# Altium project TMP-1-A.PrjPcb
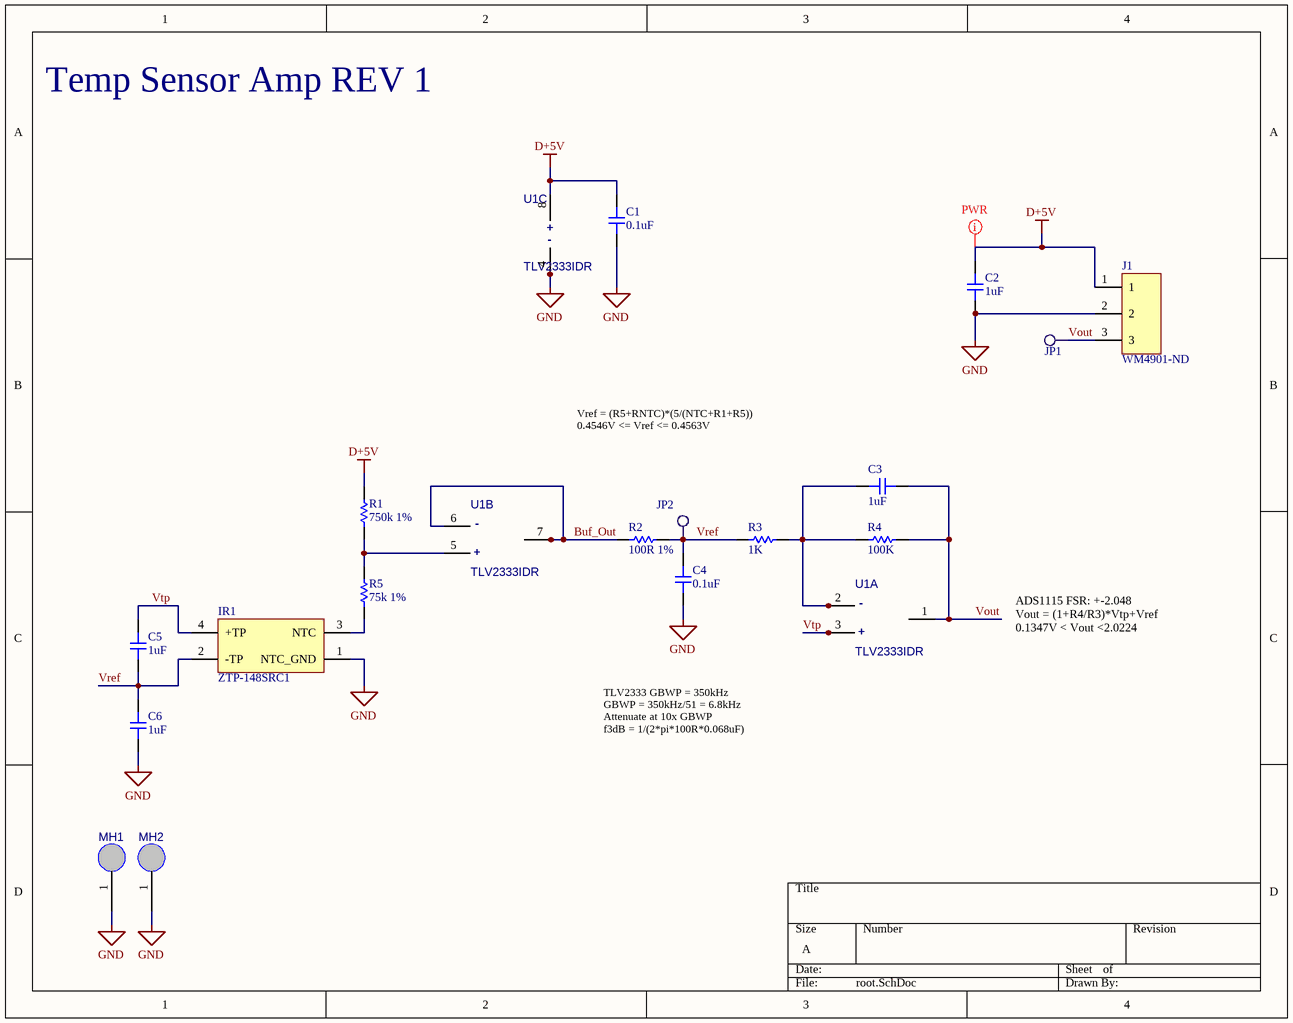
[diagram p0: root.SchDoc]
1 sheet, 18 parts. Net scope: global (net labels, ports and power ports of the same name join across sheets).
Board file: TMP-1-A.PcbDoc

## Sheet root.SchDoc
size A

### Parts
C1  0.1uF  [CAP-0603]
C2  1uF  [CAP-0603]
C3  1uF  [CAP-0603]
C4  0.1uF  [CAP-0603]
C5  1uF  [CAP-0603]
C6  1uF  [CAP-0603]
IR1  ZTP-148SRC1  [ZTP-148SRC1]
J1  WM4901-ND  [3PIN]
JP1  Testpoint2  [TP2]  (value not drawn)
JP2  Testpoint2  [TP2]  (value not drawn)
MH1  MountingHole  [MH4.2MM]  (value not drawn)
MH2  MountingHole  [MH4.2MM]  (value not drawn)
R1  750k 1%  [RES-0603]
R2  100R 1%  [RES-0603]
R3  1K  [RES-0603]
R4  100K  [RES-0603]
R5  75k 1%  [RES-0603]
U1  TLV2333IDR  [TSSOP65P505X110-8]  (parts A,B,C of 3)

### Nets
D+5V: C1.2 C2.2 J1.1 R1.2 U1.8(VDD+)
GND: C1.1 C2.1 C4.1 C6.1 IR1.1(NTC_GND) J1.2 MH1.1 MH2.1 U1.4(VDD-)
Buf_Out: R2.1 U1.6(2IN-) U1.7(2OUT)
Vout: C3.1 J1.3 JP1.1 R4.2 U1.1(1OUT)
Vref: C4.2 C5.1 C6.2 IR1.2(-TP) JP2.1 R2.2 R3.1
Vtp: C5.2 IR1.4(+TP) U1.3(1IN+)
NetC3_2: C3.2 R3.2 R4.1 U1.2(1IN-)
NetIR1_3: IR1.3(NTC) R5.1
NetR1_1: R1.1 R5.2 U1.5(2IN+)

### Layout directives
mark named PWR: D+5V

### Notes on the sheet
- Temp Sensor Amp REV 1
- Vref = (R5+RNTC)*(5/(NTC+R1+R5))
  0.4546V <= Vref <= 0.4563V
- ADS1115 FSR: +-2.048
  Vout = (1+R4/R3)*Vtp+Vref
  0.1347V < Vout <2.0224
- TLV2333 GBWP = 350kHz
  GBWP = 350kHz/51 = 6.8kHz
  Attenuate at 10x GBWP
  f3dB = 1/(2*pi*100R*0.068uF)
- (in symbol IC_TLV2333, part A) -; +
- (in symbol IC_TLV2333, part B) -; +
- (in symbol IC_TLV2333, part C) +; -

### Library data of the parts
C1 C4 = 0603-0.1uF-16V: CAP CER 0.1UF 16V X7R 0603; Manufacturer: KEMET; Manufacturer Part Number: C0603C104M4RACTU; Dielectric Material: Ceramic; Capacitance: 100nF; Tolerance: 20%; Supplier 1: Digi-Key; Stock 1: 254524; Pricing 1: 1=0.1, 10=0.036, 100=0.0161, 500=0.01152, 1000=0.00904 (USD); Mount: Surface Mount,PCB; Case/Package: 0603; Number of Pins: 2; Case Code (Metric): 1608; Case Code (Imperial): 0603; Min Operating Temperature: -55°C; Max Operating Temperature: 125°C; Package Quantity: 1; Voltage Rating: 16V; Packaging: Tape and Reel; Voltage Rating (DC): 16V; Dielectric: X7R; Termination: SMD/SMT; Length: 1.6mm; Height: 0.8mm; Width: 0.031inch; Thickness: 0.034inch; Lead Pitch: 0.7mm; Depth: 0.8mm; Radiation Hardening: No; REACH SVHC: No SVHC; ComponentLink1URL: https://www.verical.com/server-webapp/html/getDatasheet?partID=66190&src-supplier=Verical; ComponentLink1Description: https://www.verical.com/server-webapp/html/getDatasheet?partID=66190&src-supplier=Verical; ComponentLink2URL: http://www.farnell.com/datasheets/2746055.pdf?src-supplier=Element14; ComponentLink2Description: http://www.farnell.com/datasheets/2746055.pdf?src-supplier=Element14; ComponentLink3URL: http://www.farnell.com/datasheets/2123765.pdf?src-supplier=Element14; ComponentLink3Description: http://www.farnell.com/datasheets/2123765.pdf?src-supplier=Element14; ComponentLink4URL: http://www.alliedelec.com/m/d/9bfe7773041ffe9d406e68bc7b377fdd.pdf?src-supplier=Allied+Electronics; ComponentLink4Description: http://www.alliedelec.com/m/d/9bfe7773041ffe9d406e68bc7b377fdd.pdf?src-supplier=Allied+Electronics; ComponentLink5URL: https://www.verical.com/server-webapp/html/getDatasheet?partID=302288&src-supplier=Verical; ComponentLink5Description: https://www.verical.com/server-webapp/html/getDatasheet?partID=302288&src-supplier=Verical; Supplier Part Number 1: 399-1099-6-ND
C2 C3 C5 C6 = 0603-1uF-16V: CAP CER 1UF 16V X7R 0603; Manufacturer: KEMET; Manufacturer Part Number: C0603C105K4RACTU; Dielectric Material: Ceramic; Tolerance: 10%; Dissipation Factor: 3.5%; Supplier 1: Digi-Key; Stock 1: 600463; Pricing 1: 1=0.12, 10=0.088, 100=0.0391, 500=0.02792, 1000=0.02193 (USD); Mount: Surface Mount,PCB; Case/Package: 0603; Number of Pins: 2; Case Code (Metric): 1608; Case Code (Imperial): 0603; Contact Plating: Tin,Matte; Min Operating Temperature: -55°C; Max Operating Temperature: 125°C; Package Quantity: 4000; Capacitance: 1uF; Voltage Rating: 16V; Packaging: Tape and Reel; Voltage Rating (DC): 16V; Dielectric: X7R; Termination: SMD/SMT; Voltage: 16V; Length: 1.6mm; Height: 0.8mm; Width: 0.031inch; Thickness: 0.034inch; Depth: 0.8mm; Radiation Hardening: No; REACH SVHC: No SVHC; ComponentLink1URL: http://www.mouser.com/ds/2/212/KEM_C1002_X7R_SMD-1102033.pdf?src-supplier=Mouser; ComponentLink1Description: http://www.mouser.com/ds/2/212/KEM_C1002_X7R_SMD-1102033.pdf?src-supplier=Mouser; ComponentLink2URL: http://www.kemet.com/kemet/web/homepage/kechome.nsf/file/Commercial%20Ceramic%20Chips%20X7R%20Dielectric/$file/KEM_C1002_X7R_SMD.pdf?src-supplier=Element14; ComponentLink2Description: http://www.kemet.com/kemet/web/homepage/kechome.nsf/file/Commercial%20Ceramic%20Chips%20X7R%20Dielectric/$file/KEM_C1002_X7R_SMD.pdf?src-supplier=Element14; ComponentLink3URL: https://www.verical.com/server-webapp/html/getDatasheet?partID=385479&src-supplier=Verical; ComponentLink3Description: https://www.verical.com/server-webapp/html/getDatasheet?partID=385479&src-supplier=Verical; ComponentLink4URL: http://www.kemet.com/kemet/web/homepage/kechome.nsf/vapubfiles/KEM_C1002_X7R_SMD.pdf/$file/KEM_C1002_X7R_SMD.pdf?src-supplier=Element14; ComponentLink4Description: http://www.kemet.com/kemet/web/homepage/kechome.nsf/vapubfiles/KEM_C1002_X7R_SMD.pdf/$file/KEM_C1002_X7R_SMD.pdf?src-supplier=Element14; Supplier Part Number 1: 399-7847-6-ND
IR1 = IR_ZTP-148SRC1: THERMOPILE IR SENSOR with thermistor; Manufacturer: Amphenol; Supplier 1: Digi-Key; Manufacturer Part Number: ZTP-148SRC1; RoHS: No; Stock 1: 97895; Pricing 1: 1=3.10000, 10=2.80800, 25=2.51560, 50=2.22300, 100=2.16450, 500=1.81350, 1000=1.69650, 5000=1.57950 (USD); Supplier Part Number 1: 45-ZTP-148SRC1-ND
J1 = 3PIN: CONN HEADER R/A 3POS 2.54MM; Manufacturer: Molex; Manufacturer Part Number: 70553-0002; Gender: Male; Number of Positions: 3; Contact Resistance: 30mR; Current Rating: 3A; Voltage Rating: 250V; Insulation Resistance: 1GR; Approvals: UL,CSA; Glow Wire Compliant: Non-compliant; Supplier 1: Digi-Key; Stock 1: 2903; Pricing 1: 1=1.02, 10=0.893, 100=0.7702, 500=0.63018, 1000=0.56016, 5000=0.49014, 10000=0.46563 (USD); Mount: Through Hole; Housing Color: Black; Housing Material: Thermoplastic; Color: Black; Contact Plating: Gold; Contact Material: Bronze,Brass,Copper Alloy; Material: Brass; Min Operating Temperature: -40°C; Max Operating Temperature: 105°C; Packaging: Rail/Tube; Termination: Solder; Orientation: Right Angle; Number of Rows: 1; Package Quantity: 2080; Number of Contacts: 3; Contact Gender: Male; Number of Circuits: 3; Voltage Rating (DC): 250V; Pitch: 2.54mm; Radiation Hardening: No; Lead Free: Lead Free; REACH SVHC: Unknown; ELV: Compliant; Flammability Rating: UL94 V-0; ComponentLink1URL: http://www.molex.com/webdocs/datasheets/pdf/en-us/0705530002_PCB_HEADERS.pdf?src-supplier=Avnet; ComponentLink1Description: http://www.molex.com/webdocs/datasheets/pdf/en-us/0705530002_PCB_HEADERS.pdf?src-supplier=Avnet; ComponentLink2URL: http://www.onlinecomponents.com/productFiles/mf-MOL/209530705530002_pcb_headers.pdf?src-supplier=Onlinecomponents.com; ComponentLink2Description: http://www.onlinecomponents.com/productFiles/mf-MOL/209530705530002_pcb_headers.pdf?src-supplier=Onlinecomponents.com; ComponentLink3URL: http://uk.rs-online.com/webdocs/1362/0900766b81362e0f.pdf?src-supplier=RSComponents; ComponentLink3Description: http://uk.rs-online.com/webdocs/1362/0900766b81362e0f.pdf?src-supplier=RSComponents; ComponentLink4URL: http://www.jameco.com/Jameco/Products/ProdDS/1933671.pdf?src-supplier=Jameco; ComponentLink4Description: http://www.jameco.com/Jameco/Products/ProdDS/1933671.pdf?src-supplier=Jameco; ComponentLink5URL: http://www.mouser.com/ds/2/276/0705530002_PCB_HEADERS-172778.pdf?src-supplier=Mouser; ComponentLink5Description: http://www.mouser.com/ds/2/276/0705530002_PCB_HEADERS-172778.pdf?src-supplier=Mouser; Supplier Part Number 1: WM4901-ND
JP1 JP2 = Testpoint2: Single layer pad TP
MH1 MH2 = MH4.2mm: Mounting hole, 4.2mm; Case: TH
R1 = 0603-750K: RES SMD 750K OHM 1% 1/10W 0603; Manufacturer Product Number: RMCF0603FT750K; Manufacturer: Stackpole Electronics; Resistance: 750kR; Power Rating: 100mW; Temperature Coefficient: 100ppm/°C; Supplier 1: Digi-Key; Manufacturer Part Number: RMCF0603FT750K; RoHS: Yes; Category: Chip SMD Resistors; Stock 1: 145363; Pricing 1: 1=0.10000, 10=0.01600, 100=0.00650, 1000=0.00292, 2500=0.00253 (USD); Mount: Surface Mount; Case/Package: 0603; Case Code (Metric): 1608; Case Code (Imperial): 0603; Contact Plating: Tin,Matte; Size Code: 0603; Min Operating Temperature: -55°C; Max Operating Temperature: 155°C; Tolerance: 1%; Packaging: Tape and Reel; Resistor Type: Thick Film; Number of Terminations: 2; Max Power Dissipation: 100mW; Features: Automotive AEC-Q200; Series: RMCF; Length: 0.061inch; Width: 0.031inch; Height: 0.022inch; Radiation Hardening: No; Lead Free: Lead Free; RoHS Compliant: Yes; ComponentLink1URL: http://components.arrow.com/part/dataview/44988031S7440371N1174?src-supplier=Arrow+Electronics; ComponentLink1Description: http://components.arrow.com/part/dataview/44988031S7440371N1174?src-supplier=Arrow+Electronics; ComponentLink2URL: https://www.seielect.com/Catalog/SEI-RMCF_RMCP.pdf?src-supplier=Digi-Key; ComponentLink2Description: https://www.seielect.com/Catalog/SEI-RMCF_RMCP.pdf?src-supplier=Digi-Key; ComponentLink3URL: https://www.seielect.com/catalog/SEI-Packaging.pdf?src-supplier=Digi-Key; ComponentLink3Description: https://www.seielect.com/catalog/SEI-Packaging.pdf?src-supplier=Digi-Key; ComponentLink4URL: http://www.seielect.com/Catalog/SEI-RMC.pdf?src-supplier=Future+Electronics; ComponentLink4Description: http://www.seielect.com/Catalog/SEI-RMC.pdf?src-supplier=Future+Electronics; ComponentLink5URL: https://www.seielect.com/catalog/SEI-RMCF_RMCP.pdf?src-supplier=Avnet; ComponentLink5Description: https://www.seielect.com/catalog/SEI-RMCF_RMCP.pdf?src-supplier=Avnet; Supplier Part Number 1: RMCF0603FT750KCT-ND
R2 = 0603-100R: RES 100 OHM 1% 1/8W 0603; Manufacturer Product Number: RNCP0603FTD100R; Manufacturer: Stackpole Electronics; Max Power Dissipation: 125mW; Temperature Coefficient: 100ppm/°C; Supplier 1: Digi-Key; Manufacturer Part Number: RNCP0603FTD100R; RoHS: Yes; Category: Chip SMD Resistors; Stock 1: 158067; Pricing 1: 1=0.10000, 10=0.05800, 100=0.02360, 1000=0.01060, 2500=0.00920 (USD); Mount: Surface Mount; Case/Package: 0603; Case Code (Metric): 1608; Case Code (Imperial): 0603; Contact Plating: Tin,Matte; Min Operating Temperature: -55°C; Max Operating Temperature: 155°C; Resistance: 100R; Tolerance: 1%; Packaging: Tape and Reel; Resistor Type: Thin Film; Number of Terminations: 2; Features: Moisture Resistant,Anti-Sulfur; Series: RNCP; Length: 0.059inch; Width: 0.031inch; Height: 0.02inch; Radiation Hardening: No; Lead Free: Lead Free; RoHS Compliant: Yes; ComponentLink1URL: https://www.seielect.com/catalog/SEI-Packaging.pdf?src-supplier=Digi-Key; ComponentLink1Description: https://www.seielect.com/catalog/SEI-Packaging.pdf?src-supplier=Digi-Key; ComponentLink2URL: https://www.seielect.com/Catalog/SEI-rncp.pdf?src-supplier=Avnet; ComponentLink2Description: https://www.seielect.com/Catalog/SEI-rncp.pdf?src-supplier=Avnet; Supplier Part Number 1: RNCP0603FTD100RCT-ND
R3 = 0603-1KR: RES SMD 1K OHM 1% 1/10W 0603; Manufacturer: Vishay Dale; Manufacturer Part Number: CRCW06031K00FKEA; Resistance: 1kR; Power Rating: 100mW; Voltage Rating: 75V; Temperature Coefficient: 100ppm/°C; Supplier 1: Digi-Key; Stock 1: 671453; Pricing 1: 1=0.1, 10=0.034, 100=0.0139, 1000=0.00623, 2500=0.0054 (USD); Mount: Surface Mount; Case/Package: 0603; Number of Pins: 2; Weight: 7.1E-05oz; Case Code (Metric): 1608; Case Code (Imperial): 0603; Contact Plating: Tin; Min Operating Temperature: -55°C; Max Operating Temperature: 155°C; Composition: Thick Film; Tolerance: 1%; Packaging: Tape and Reel; Package Quantity: 10; Number of Terminations: 2; Termination: SMD/SMT; Military Standard: Not; Max Power Dissipation: 100mW; Voltage Rating (DC): 75V; Features: Automotive AEC-Q200; Length: 1.55mm; Height: 0.45mm; Width: 0.033inch; Depth: 0.85mm; Radiation Hardening: No; REACH SVHC: Unknown; Lead Free: Lead Free; ComponentLink1URL: http://www.vishay.com/docs/20035/dcrcwe3.pdf?src-supplier=Digi-Key; ComponentLink1Description: http://www.vishay.com/docs/20035/dcrcwe3.pdf?src-supplier=Digi-Key; ComponentLink2URL: http://uk.rs-online.com/webdocs/0d98/0900766b80d98afc.pdf?src-supplier=RSComponents; ComponentLink2Description: http://uk.rs-online.com/webdocs/0d98/0900766b80d98afc.pdf?src-supplier=RSComponents; ComponentLink3URL: http://www.vishay.com/docs/20035/dcrcwe3.pdf?src-supplier=Avnet; ComponentLink3Description: http://www.vishay.com/docs/20035/dcrcwe3.pdf?src-supplier=Avnet; ComponentLink4URL: http://www.vishay.com/docs/20035/dcrcwe3.pdf?src-supplier=Avnet+Asia; ComponentLink4Description: http://www.vishay.com/docs/20035/dcrcwe3.pdf?src-supplier=Avnet+Asia; ComponentLink5URL: http://www.farnell.com/datasheets/2310790.pdf?src-supplier=Element14; ComponentLink5Description: http://www.farnell.com/datasheets/2310790.pdf?src-supplier=Element14; ComponentLink6URL: https://www.distrelec.biz/Web/Downloads/a_/en/flD-CRCW-e3_data_en.pdf?mime=application%2Fpdf&src-supplier=Distrelec; ComponentLink6Description: https://www.distrelec.biz/Web/Downloads/a_/en/flD-CRCW-e3_data_en.pdf?mime=application%2Fpdf&src-supplier=Distrelec; ComponentLink7URL: http://www.vishay.com/docs/20035/dcrcwe3.pdf?src-supplier=Future+Electronics; ComponentLink7Description: http://www.vishay.com/docs/20035/dcrcwe3.pdf?src-supplier=Future+Electronics; ComponentLink8URL: http://www.vishay.com/docs/20035/dcrcwe3.pdf?src-supplier=Avnet+Europe; ComponentLink8Description: http://www.vishay.com/docs/20035/dcrcwe3.pdf?src-supplier=Avnet+Europe; Supplier Part Number 1: 541-1.00KHCT-ND
R4 = 0603-100KR: RES 100K OHM 1% 1/10W 0603; Manufacturer: Stackpole Electronics; Manufacturer Part Number: RMCF0603FT100K; Resistance: 100kR; Power Rating: 100mW; Temperature Coefficient: 100ppm/°C; Working Voltage: 75V; Supplier 1: Digi-Key; Stock 1: 1428218; Pricing 1: 1=0.1, 10=0.016, 100=0.0065, 1000=0.00292, 2500=0.00253 (USD); Mount: Surface Mount; Case/Package: 0603; Case Code (Metric): 1608; Case Code (Imperial): 0603; Contact Plating: Tin,Matte; Min Operating Temperature: -55°C; Max Operating Temperature: 155°C; Packaging: Tape and Reel; Tolerance: 1%; Composition: Thick Film; Number of Terminations: 2; Military Standard: Not; Max Power Dissipation: 100mW; Features: Automotive AEC-Q200; Length: 1.55mm; Height: 0.022inch; Width: 0.031inch; Depth: 0.8mm; Radiation Hardening: No; Lead Free: Lead Free; ComponentLink1URL: https://www.verical.com/server-webapp/html/getDatasheet?partID=362597&src-supplier=Verical; ComponentLink1Description: https://www.verical.com/server-webapp/html/getDatasheet?partID=362597&src-supplier=Verical; Supplier Part Number 1: RMCF0603FT100KDKR-ND
R5 = 0603-75K: 75 kohm, 75 V, 0603 [1608 Metric], 100 mW,  1%; Manufacturer Product Number: MCT06030C7502FP500; Manufacturer: Vishay BCcomponents; Resistance: 75kR; Temperature Coefficient: 50ppm/°C; Power Rating: 100mW; Voltage Rating: 75V; Max Power Dissipation: 125mW; Supplier 1: Digi-Key; Manufacturer Part Number: MCT06030C7502FP500; RoHS: Yes; Category: Chip SMD Resistors; Stock 1: 36307; Pricing 1: 1=0.13000, 10=0.12100, 100=0.04650, 1000=0.02046, 2500=0.01767 (USD); Mount: Surface Mount; Case/Package: 0603; Contact Plating: Tin; Case Code (Metric): 1608; Case Code (Imperial): 0603; Min Operating Temperature: -55°C; Max Operating Temperature: 125°C; Tolerance: 1%; Resistor Type: Thin Film; Packaging: Tape and Reel; Package Quantity: 5000; Number of Terminations: 2; Voltage Rating (DC): 75V; Series: MCT 0603 - Professional; Resistance Tolerance: 1%; Construction: Rectangular; Length: 0.061inch; Width: 0.033inch; Height: 0.022inch; Depth: 0.85mm; Radiation Hardening: No; REACH SVHC: Unknown; Military Standard: Not; Lead Free: Lead Free; RoHS Compliant: Yes; ComponentLink1URL: https://datasheet.ciiva.com/2571/mc-pro-2571677.pdf?src-supplier=Digi-Key; ComponentLink1Description: https://datasheet.ciiva.com/2571/mc-pro-2571677.pdf?src-supplier=Digi-Key; ComponentLink2URL: https://datasheet.ciiva.com/16854/mc-pro-16854780.pdf?src-supplier=Avnet+Europe; ComponentLink2Description: https://datasheet.ciiva.com/16854/mc-pro-16854780.pdf?src-supplier=Avnet+Europe; Supplier Part Number 1: 749-1681-1-ND
U1 = IC_TLV2333: IC OP AMP ZERO-DRIFT CMOS 8SOIC; Manufacturer: Texas Instruments; Number of Circuits: 2; Slew Rate: 0.16V/µs; Gain Bandwidth Product: 350kHz; Input Bias Current: 70pA; Input Offset Voltage (Vos): 2uV; Operating Supply Current: 17uA; Output Current per Channel: 5mA; Supplier 1: Digi-Key; Manufacturer Part Number: TLV2333IDR; RoHS: Yes; Category: Amplifiers - Op Amps, Buffer, Instrumentation; Stock 1: 6297; Pricing 1: 1=1.90000, 10=1.70500, 25=1.60840, 100=1.28680, 250=1.12600, 500=1.09382, 1000=0.86862 (USD); Mount: Surface Mount; Case/Package: SOIC; Number of Pins: 8; Min Operating Temperature: -40°C; Max Operating Temperature: 125°C; Packaging: Tape and Reel; Number of Channels: 2; Lead Free: Lead Free; RoHS Compliant: Yes; ComponentLink1URL: http://www.ti.com/lit/ds/symlink/tlv2333.pdf?src-supplier=Digi-Key; ComponentLink1Description: http://www.ti.com/lit/ds/symlink/tlv2333.pdf?src-supplier=Digi-Key; ComponentLink2URL: http://www.ti.com/lit/gpn/tlv2333?src-supplier=Mouser; ComponentLink2Description: http://www.ti.com/lit/gpn/tlv2333?src-supplier=Mouser; Supplier Part Number 1: 296-43772-1-ND